# Altium project TNY268PN_12V_1A_SMPS.PrjPcb
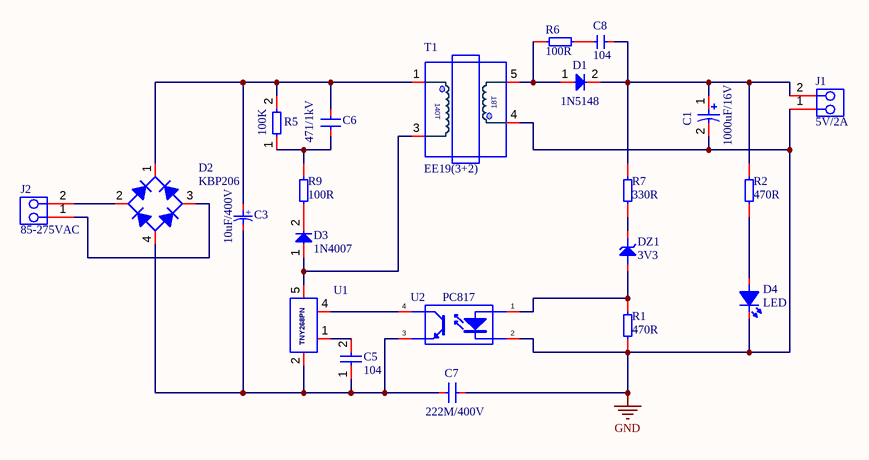
[diagram p0: TNY268PN_12V_1A_SMPS.SchDoc]
1 sheet, 22 parts. Net scope: global (net labels, ports and power ports of the same name join across sheets).
Board files: TNY268PN_12V_1A_SMPS.PcbDoc, PCB2.PcbDoc

## Sheet TNY268PN_12V_1A_SMPS.SchDoc
size A4; SheetNumber: 1; SheetTotal: 1

### Parts
C1  1000uF/16V  [CAP_RAD_3.5mm]
C3  10uF/400V  [CAP_RAD_D10x12.5_POL_BK]
C5  104  [CAP_Ceramic_Disc_2]
C6  471/1kV  [CAP_DISC_4x3_YL]
C7  222M/400V  [CAP_DISC_Y2222]
C8  104  [CAP_Ceramic_Disc_2]
D1  1N5148  [DO-41]
D2  KBP206  [DIODE-KBP206]
D3  1N4007  [DO-41]
D4  LED  [LED_3MM_RED]
DZ1  3V3  [DO-35 Horizontal]
J1  5V/2A  [DG306-5.0-02P-12-00AH]
J2  85-275VAC  [DG127-5.0-02P-14-00AH]
R1  470R  [RES-0.25W-H-MF]
R2  470R  [RES-0.25W-H-MF]
R5  100K  [RES-0.25W-H-MF]
R6  100R  [RES-0.25W-H-MF]
R7  330R  [RES-0.25W-H-MF]
R9  100R  [RES-0.25W-H-MF]
T1  EE19(3+2)  [TRANSFORMER-EE19(3+2)]
U1  TNY268PN  [DIP8-TNY268]  (value not drawn)
U2  PC817  [DIP4]

### Nets
GND: C1.2 C7.2 D4.2(K) J1.1 R1.1 T1.4 U2.2(K)
NetC1_1: C1.1 C8.2 D1.2 J1.2 R2.2 R7.2
NetC3_1: C3.1 C6.2 D2.1(+) R5.2 T1.1
NetC3_2: C3.2 C5.1 C7.1 D2.4(-) U1.2 U2.3(E)
NetC5_2: C5.2 U1.1
NetC6_1: C6.1 R5.1 R9.2
NetC8_1: C8.1 R6.2
NetD1_1: D1.1 R6.1 T1.5
NetD2_2: D2.2(AC) J2.2
NetD2_3: D2.3(AC) J2.1
NetD3_1: D3.1 T1.3 U1.5
NetD3_2: D3.2 R9.1
NetD4_1: D4.1(A) R2.1
NetDZ1_1: DZ1.1 R1.2 U2.1(A)
NetDZ1_2: DZ1.2 R7.1
NetU1_4: U1.4 U2.4(C)

### Notes on the sheet
- (near T1) 140T
- (near T1) 18T
- (in symbol Capacitor(Radian)) +

### Library data of the parts
C1 C3 = Capacitor(Radian)
C5-C8 = Capacitors(Disc)
D1 D3 = Diode-1N4007
D2 = Diode-KBP206
D4 = LED 3MM
DZ1 = Diode-Zener
J1 = DG306-5.0-02P-12-00AH
J2 = DG127-5.0-02P-14-00AH
R1 R2 R5-R7 R9 = Resistors THD
T1 = TRANS-EE19-VERTICAL(3+2)
U1 = TNY268PN: TinySwitch-II: TNY263, TNY264, TNY265, TNY266, TNY267 a TNY268